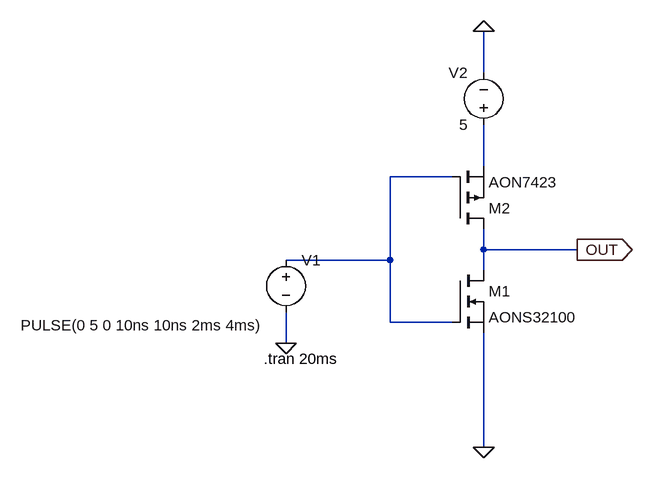
[diagram p0: schematic NOT.asc]
NOT.asc, the LTspice schematic file:
Version 4
SHEET 1 880 680
WIRE 240 -144 240 -208
WIRE 240 0 240 -64
WIRE 192 16 96 16
WIRE 240 128 240 96
WIRE 384 128 240 128
WIRE 96 144 96 16
WIRE 96 144 -64 144
WIRE 240 160 240 128
WIRE 96 240 96 144
WIRE 192 240 96 240
WIRE -64 272 -64 224
WIRE 240 432 240 256
FLAG -64 272 0
FLAG 240 432 0
FLAG 240 -208 0
FLAG 384 128 OUT
IOPIN 384 128 Out
SYMBOL nmos 192 160 R0
SYMATTR InstName M1
SYMATTR Value AONS32100
SYMBOL voltage -64 128 R0
WINDOW 3 -408 116 Left 2
WINDOW 123 0 0 Left 0
WINDOW 39 0 0 Left 0
SYMATTR InstName V1
SYMATTR Value PULSE(0 5 0 10ns 10ns 2ms 4ms)
SYMBOL voltage 240 -48 R180
WINDOW 0 24 96 Left 2
WINDOW 3 24 16 Left 2
WINDOW 123 0 0 Left 0
WINDOW 39 0 0 Left 0
SYMATTR InstName V2
SYMATTR Value 5
SYMBOL pmos 192 96 M180
SYMATTR InstName M2
SYMATTR Value AON7423
TEXT -98 296 Left 2 !.tran 20ms

The netlist it stands for:
* NOT.asc
M1 OUT N002 0 0 AONS32100
V1 N002 0 PULSE(0 5 0 10ns 10ns 2ms 4ms)
V2 N001 0 5
M2 OUT N002 N001 N001 AON7423
.model NMOS NMOS
.model PMOS PMOS
.lib standard.mos
.tran 20ms
.backanno
.end